# Altium schematic sheet CompressorIface.SchDoc
size A; SheetNumber: 3; SheetTotal: 5
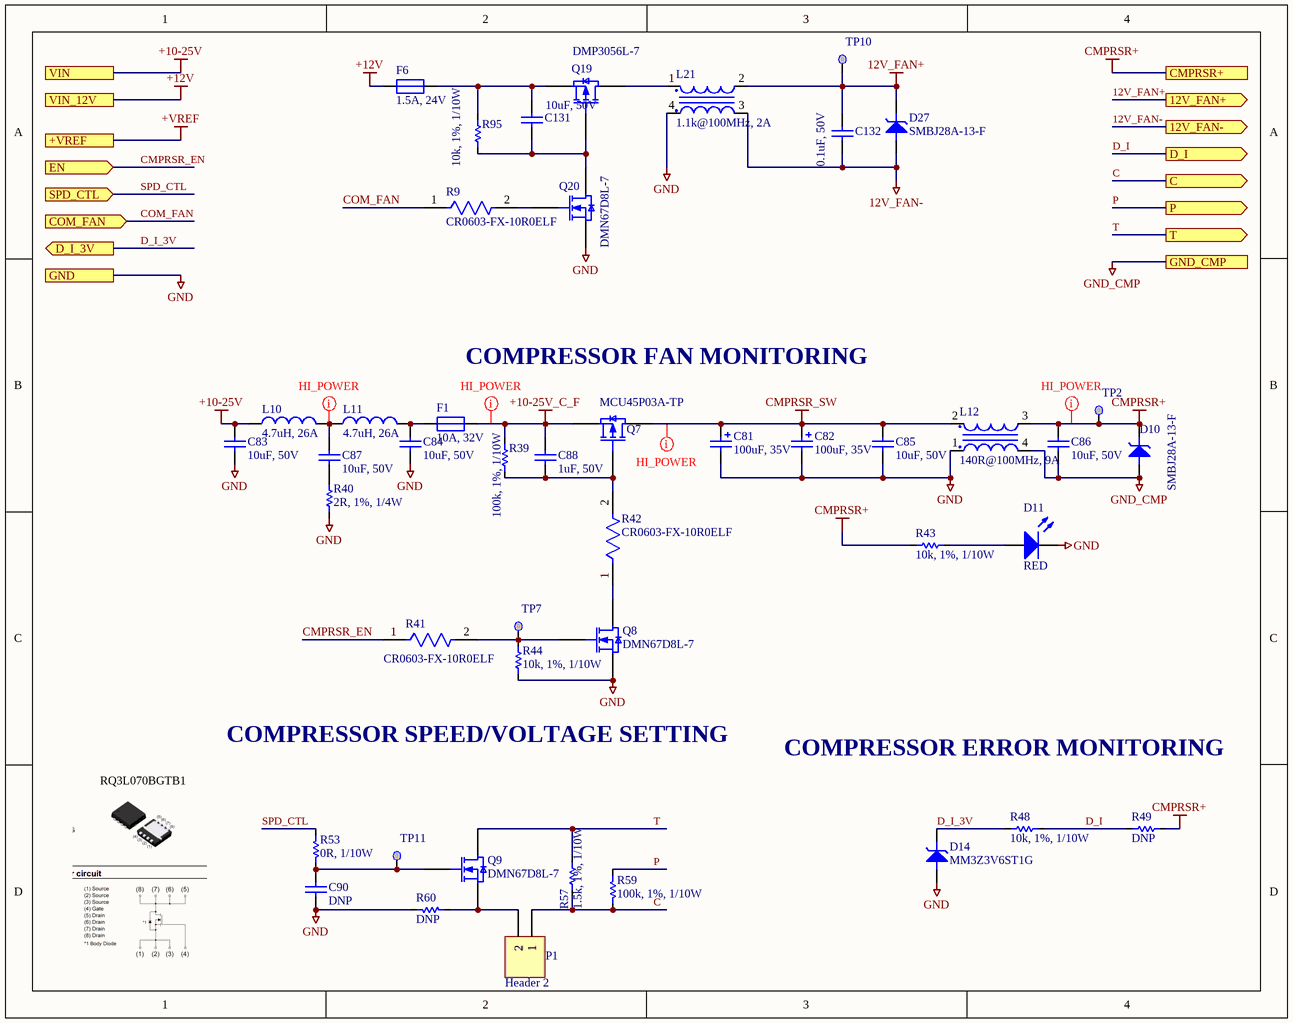
[diagram p0: CompressorIface.SchDoc]

## Parts
C81  100uF, 35V  [CAPAE7866X80L]
C82  100uF, 35V  [CAPAE7866X80L]
C83  10uF, 50V  [1206]
C84  10uF, 50V  [1206]
C85  10uF, 50V  [1206]
C86  10uF, 50V  [1206]
C87  10uF, 50V  [1206]
C88  1uF, 50V  [0805]
C90  DNP  [0805]
C131  10uF, 50V  [1206]
C132  0.1uF, 50V  [0603]
D10  SMBJ28A-13-F  [SMB]
D11  RED  [0603_DIODE_K1A2]
D14  MM3Z3V6ST1G  [SOD323]
D27  SMBJ28A-13-F  [SMB]
F1  10A, 32V  [RAD_TH_1.3DIAx10.2Px27.9H]
F6  1.5A, 24V  [1812_CAP]
L10  4.7uH, 26A  [INDM178169X70N]
L11  4.7uH, 26A  [INDM178169X70N]
L12  140R@100MHz, 9A  [CHOKE_SMD_7.0X6.0X3.8]
L21  1.1k@100MHz, 2A  [PLCC440P435X370X235-4L]
P1  Header 2  [HDR1X2]
Q7  MCU45P03A-TP  [DPAK]
Q8  DMN67D8L-7  [SOT23-3]
Q9  DMN67D8L-7  [SOT23-3]
Q19  DMP3056L-7  [SOT23-3]
Q20  DMN67D8L-7  [SOT23-3]
R9  CR0603-FX-10R0ELF  [FP-CR0603-MFG]
R39  100k, 1%, 1/10W  [0603]
R40  2R, 1%, 1/4W  [1206]
R41  CR0603-FX-10R0ELF  [FP-CR0603-MFG]
R42  CR0603-FX-10R0ELF  [FP-CR0603-MFG]
R43  10k, 1%, 1/10W  [0603]
R44  10k, 1%, 1/10W  [0603]
R48  10k, 1%, 1/10W  [0603]
R49  DNP  [0603]
R53  0R, 1/10W  [0603]
R57  1.5k, 1%, 1/10W  [0603]
R59  100k, 1%, 1/10W  [0603]
R60  DNP  [0603]
R95  10k, 1%, 1/10W  [0603]
TP2  Test Point  [TEST POINT 40 Mil]  (value not drawn)  (no BOM)
TP7  Test Point  [TEST POINT 40 Mil]  (value not drawn)  (no BOM)
TP10  Test Point  [TEST POINT 40 Mil]  (value not drawn)  (no BOM)
TP11  Test Point  [TEST POINT 40 Mil]  (value not drawn)  (no BOM)

## Ports
12V_FAN+ (out), 12V_FAN- (out), +VREF, C (out), CMPRSR+, COM_FAN (in), D_I (out), D_I_3V (out), EN (in), GND, GND_CMP, P (out), SPD_CTL (in), T (out), VIN, VIN_12V

## Nets
12V_FAN+: C132.2 D27.2(K) L21.2 TP10.1 ; port 12V_FAN+
12V_FAN-: C132.1 D27.1(A) L21.3 ; port 12V_FAN-
+10-25V: C83.2 L10.1 ; port VIN
+10-25V_C_F: C88.2 F1.1(A) Q7.3(S) R39.2
+12V: F6.2(K) ; port VIN_12V
+VREF: port +VREF
CMPRSR+: C86.2 D10.2(K) L12.3 R43.2 R49.1 TP2.1 ; port CMPRSR+
CMPRSR_SW: C81.1 C82.1 C85.2 L12.2 Q7.2(D)
GND: C81.2 C82.2 C83.1 C84.1 C85.1 C90.1 D11.2(K) D14.1(A) L12.1 L21.4 Q8.2(S) Q20.2(S) R40.1 R44.1 R60.1 ; port GND
GND_CMP: C86.1 D10.1(A) L12.4 ; port GND_CMP
C: P1.1 R57.1 R59.2 ; port C
CMPRSR_EN: R41.1 ; port EN
COM_FAN: R9.1 ; port COM_FAN
D_I: R48.1 R49.2 ; port D_I
D_I_3V: D14.2(K) R48.2 ; port D_I_3V
P: R59.1 ; port P
SPD_CTL: R53.1 ; port SPD_CTL
T: Q9.3(D) R57.2 ; port T
NetC84_2: C84.2 F1.2(K) L11.2
NetC87_1: C87.1 R40.2
NetC87_2: C87.2 L10.2 L11.1
NetC88_1: C88.1 Q7.1(G) R39.1 R42.2
NetC90_2: C90.2 Q9.1(G) R53.2 TP11.1
NetC131_1: C131.1 F6.1(A) Q19.2(S) R95.1
NetC131_2: C131.2 Q19.1(G) Q20.3(D) R95.2
NetD11_1: D11.1(A) R43.1
NetL21_1: L21.1 Q19.3(D)
NetP1_2: P1.2 Q9.2(S) R60.2
NetQ8_1: Q8.1(G) R41.2 R44.2 TP7.1
NetQ8_3: Q8.3(D) R42.1
NetQ20_1: Q20.1(G) R9.2

## Layout directives
net class HI_POWER: +10-25V_C_F, CMPRSR+, CMPRSR_SW, NetC87_2

## Notes on the sheet
- COMPRESSOR FAN MONITORING
- COMPRESSOR SPEED/VOLTAGE SETTING
- COMPRESSOR ERROR MONITORING
- RQ3L070BGTB1

## Library data of the parts
C81 C82 = NS00911: CAP ALUM 100UF 20% 35V SMD; Type: C; Alternatives: Generic; Part Number: NS00911; Value: 100uF, 35V; Supplier 1: Digi-Key; Supplier Part Number 1: PCE5051CT-ND
C83-C87 C131 = NS00832: CAP CER 10UF 50V X7R 1206; Type: C; Alternatives: Generic; Part Number: NS00832; Value: 10uF, 50V; Supplier 1: Digi-Key; Supplier Part Number 1: 1276-6767-1-ND
C88 = NS00871: CAP CER 1UF 50V X7R 0805; Type: C; Alternatives: Generic; Part Number: NS00871; Value: 1uF, 50V; Supplier 1: Digi-Key; Supplier Part Number 1: 1276-6470-1-ND
C90 = NS00353: 0.10µF ±10% 50V Ceramic Capacitor X7R 0805 (2012 Metric); Type: C; Value: 0.1uF, 50V; Alternatives: Generic; Part Number: NS00353; Supplier 1: Digi-Key; Supplier Part Number 1: 478-1395-1-ND
C132 = NS00838: CAP CER 0.1UF 50V X7R 0603; Type: C; Alternatives: Generic; Part Number: NS00838; Value: 0.1uF, 50V; Supplier 1: Digi-Key; Supplier Part Number 1: 1276-1935-1-ND
D10 D27 = NS00891: TVS DIODE 28VWM 45.4VC SMB; Part Number: NS00891; Type: Diode; Value: SMBJ28A-13-F; ComponentLink1Description: Datasheet; ComponentLink1URL: H:\Doc\Diodes\ds19002-2.pdf; Supplier 1: Digi-Key; Supplier Part Number 1: SMBJ28A-FDICT-ND
D11 = NS00945: LED RED CLEAR 1608 SMD; Type: IC; Part Number: NS00945; Value: RED; ComponentLink1Description: Datasheet; ComponentLink1URL: H:\Doc\Harvatek\B1911USD-20D000114U1930.pdf; Supplier 1: Digi-Key; Supplier Part Number 1: 3147-B1911USD-20D000114U1930CT-ND
D14 = NS00914: DIODE ZENER 3V 300MW SOD323; Part Number: NS00914; Type: Diode; Value: MM3Z3V6ST1G; ComponentLink1Description: Datasheet; ComponentLink1URL: H:\Doc\ONsemi\MM3Z2V4ST1-D.PDF; Supplier 1: Digi-Key; Supplier Part Number 1: MM3Z3V0ST1GOSCT-ND
F1 = NS00921: PTC RESET FUSE 32V 10A RADIAL; Alternatives: Generic; Part Number: NS00921; Type: Fuse; Value: 10A, 32V; Supplier 1: Digi-Key; Supplier Part Number 1: 507-0ZRS1000FF1A-ND
F6 = NS00950: PTC RESET FUSE 24V 1.5A 1812; Alternatives: Generic; Part Number: NS00950; Type: Fuse; Value: 1.5A, 24V; Supplier 1: Digi-Key; Supplier Part Number 1: 507-1773-1-ND
L10 L11 = NS00854: FIXED IND 4.7UH 26A 5.5 MOHM SMD; Part Number: NS00854; Type: Inductor; Value: 4.7uH, 26A; ComponentLink1Description: Datasheet; ComponentLink1URL: H:\Doc\Bourns\srp1770c.pdf; Supplier 1: Digi-Key; Supplier Part Number 1: SRP1770C-4R7MCT-ND
L12 = NS00944: CMC 1.8UH 9A 2LN 140 OHM SMD553-4125-1-ND; Type: Inductor; Part Number: NS00944; Value: 140R@100MHz, 9A; ComponentLink1Description: Datasheet; ComponentLink1URL: H:\Doc\Eaton\datasheet_p850_1608182804.pdf; Supplier 1: Digi-Key; Supplier Part Number 1: 553-4125-1-ND
L21 = CHOKE_COMMON_ALT: CMC 2A 2LN 1.1K OHM SMD; Part Number: NS00952; Type: Inductor; Value: 1.1k@100MHz, 2A; ComponentLink1Description: Datasheet; ComponentLink1URL: H:\Doc\Murata\EFLC0026.pdf; Supplier 1: Digi-Key; Supplier Part Number 1: 490-12641-1-ND
P1 = Header 2: Header, 2-Pin; LatestRevisionDate: 17-Jul-2002; LatestRevisionNote: Re-released for DXP Platform.; Publisher: Altium Limited
Q7 = NS00810: P-CHANNEL MOSFET, DPAK; Type: IC; Part Number: NS00810; Value: MCU45P03A-TP; ComponentLink1Description: Datasheet; ComponentLink1URL: H:\Doc\MicroCommercial\MCU45P03A(DPAK).pdf; Supplier 1: Digi-Key; Supplier Part Number 1: 353-MCU45P03A-TPCT-ND
Q8 Q9 Q20 = NS00873: MOSFET N-CH 60V 210MA SOT23; Type: IC; Published: 8-Jun-2000; LatestRevisionDate: 17-Jul-2002; LatestRevisionNote: Re-released for DXP Platform.; PackageVersion: 1995/1996; PackageReference: E3; Publisher: Altium Limited; Part Number: NS00873; Value: DMN67D8L-7; ComponentLink1Description: Datasheet; ComponentLink1URL: H:\Doc\Diodes\DMN67D8L.pdf; Supplier 1: Digi-Key; Supplier Part Number 1: DMN67D8L-7DICT-ND
Q19 = NS00910: MOSFET P-CH 30V 4.3A SOT23; Type: IC; Part Number: NS00910; Value: DMP3056L-7; ComponentLink1Description: Datasheet; ComponentLink1URL: H:\Doc\Diodes\DMP3056L.pdf; Supplier 1: Digi-Key; Supplier Part Number 1: DMP3056L-7DICT-ND
R9 R41 R42 = CMP-1012-00284-2: Thick Film Chip Resistors 0603 10Ω 0.1W 1% 100ppm/°C; Max Power Dissipation: 100mW; Resistance: 10R; Voltage Rating: 50V; Depth: 0.8mm; REACH SVHC: No SVHC; Package Quantity: 1; Thickness: 457um; Length: 1.6mm; Tolerance: 1%; Width: 0.8mm; Number of Pins: 2; Height: 0.45mm; Military Standard: Not; Features: Moisture Resistant; Packaging: Tape and Reel; Case/Package: 0603; Power Rating: 100mW; Voltage Rating (DC): 50V; Radiation Hardening: No; Mount: Surface Mount; Min Operating Temperature: -55°C; Composition: Thick Film; Max Operating Temperature: 155°C; Termination: SMD/SMT; Temperature Coefficient: 100ppm/°C; Case Code (Imperial): 0603; Case Code (Metric): 1608; Number of Terminations: 2; Contact Plating: Tin
R39 = NS00835: RES 100K OHM 1% 1/10W 0603; Alternatives: Generic; Part Number: NS00835; Type: R; Value: 100k, 1%, 1/10W; Supplier 1: Digi-Key; Supplier Part Number 1: RMCF0603FT100KCT-ND
R40 = NS00946: RES 2 OHM 1% 1/4W 1206; Alternatives: Generic; Part Number: NS00946; Type: R; Value: 2R, 1%, 1/4W; Supplier 1: Digi-Key; Supplier Part Number 1: 738-RMCF1206FT2R00CT-ND
R43 R44 R48 R95 = NS00820: RES 10K OHM 1% 1/10W 0603; Alternatives: Generic; Part Number: NS00820; Type: R; Value: 10k, 1%, 1/10W; Supplier 1: Digi-Key; Supplier Part Number 1: RMCF0603FT10K0CT-ND
R49 = NS00820: RES 10K OHM 1% 1/10W 0603; Value: 10k, 1%, 1/10W; Alternatives: Generic; Part Number: NS00820; Type: R; Supplier 1: Digi-Key; Supplier Part Number 1: RMCF0603FT10K0CT-ND
R53 = NS00876: RES 0 OHM JUMPER 1/10W 0603; Alternatives: Generic; Part Number: NS00876; Type: R; Value: 0R, 1/10W; Supplier 1: Digi-Key; Supplier Part Number 1: RMCF0603ZT0R00CT-ND
R57 = NS00951: RES 1.5K OHM 1% 1/10W 0603; Alternatives: Generic; Part Number: NS00951; Type: R; Value: 1.5k, 1%, 1/10W; Supplier 1: Digi-Key; Supplier Part Number 1: 311-1.50KHRTR-ND
R59 = NS00915: RES SMD 100K OHM 1% 1/10W 0603; Alternatives: Generic; Part Number: NS00915; Type: R; Value: 100k, 1%, 1/10W; Supplier 1: Digi-Key; Supplier Part Number 1: YAG3579CT-ND
R60 = NS00876: RES 300kOHM JUMPER 1/10W 0603; Value: 300k, 1/10W; Alternatives: Generic; Part Number: NS00876; Type: R; Supplier 1: Digi-Key; Supplier Part Number 1: RMCF0603ZT0R00CT-ND
TP2 TP7 TP10 TP11 = Test Point: Test Point 0.3mm; PartType: Mechanical; ComponentLink1Description: Datasheet